# EAGLE board keyBoard_A (EAGLE 6.4)
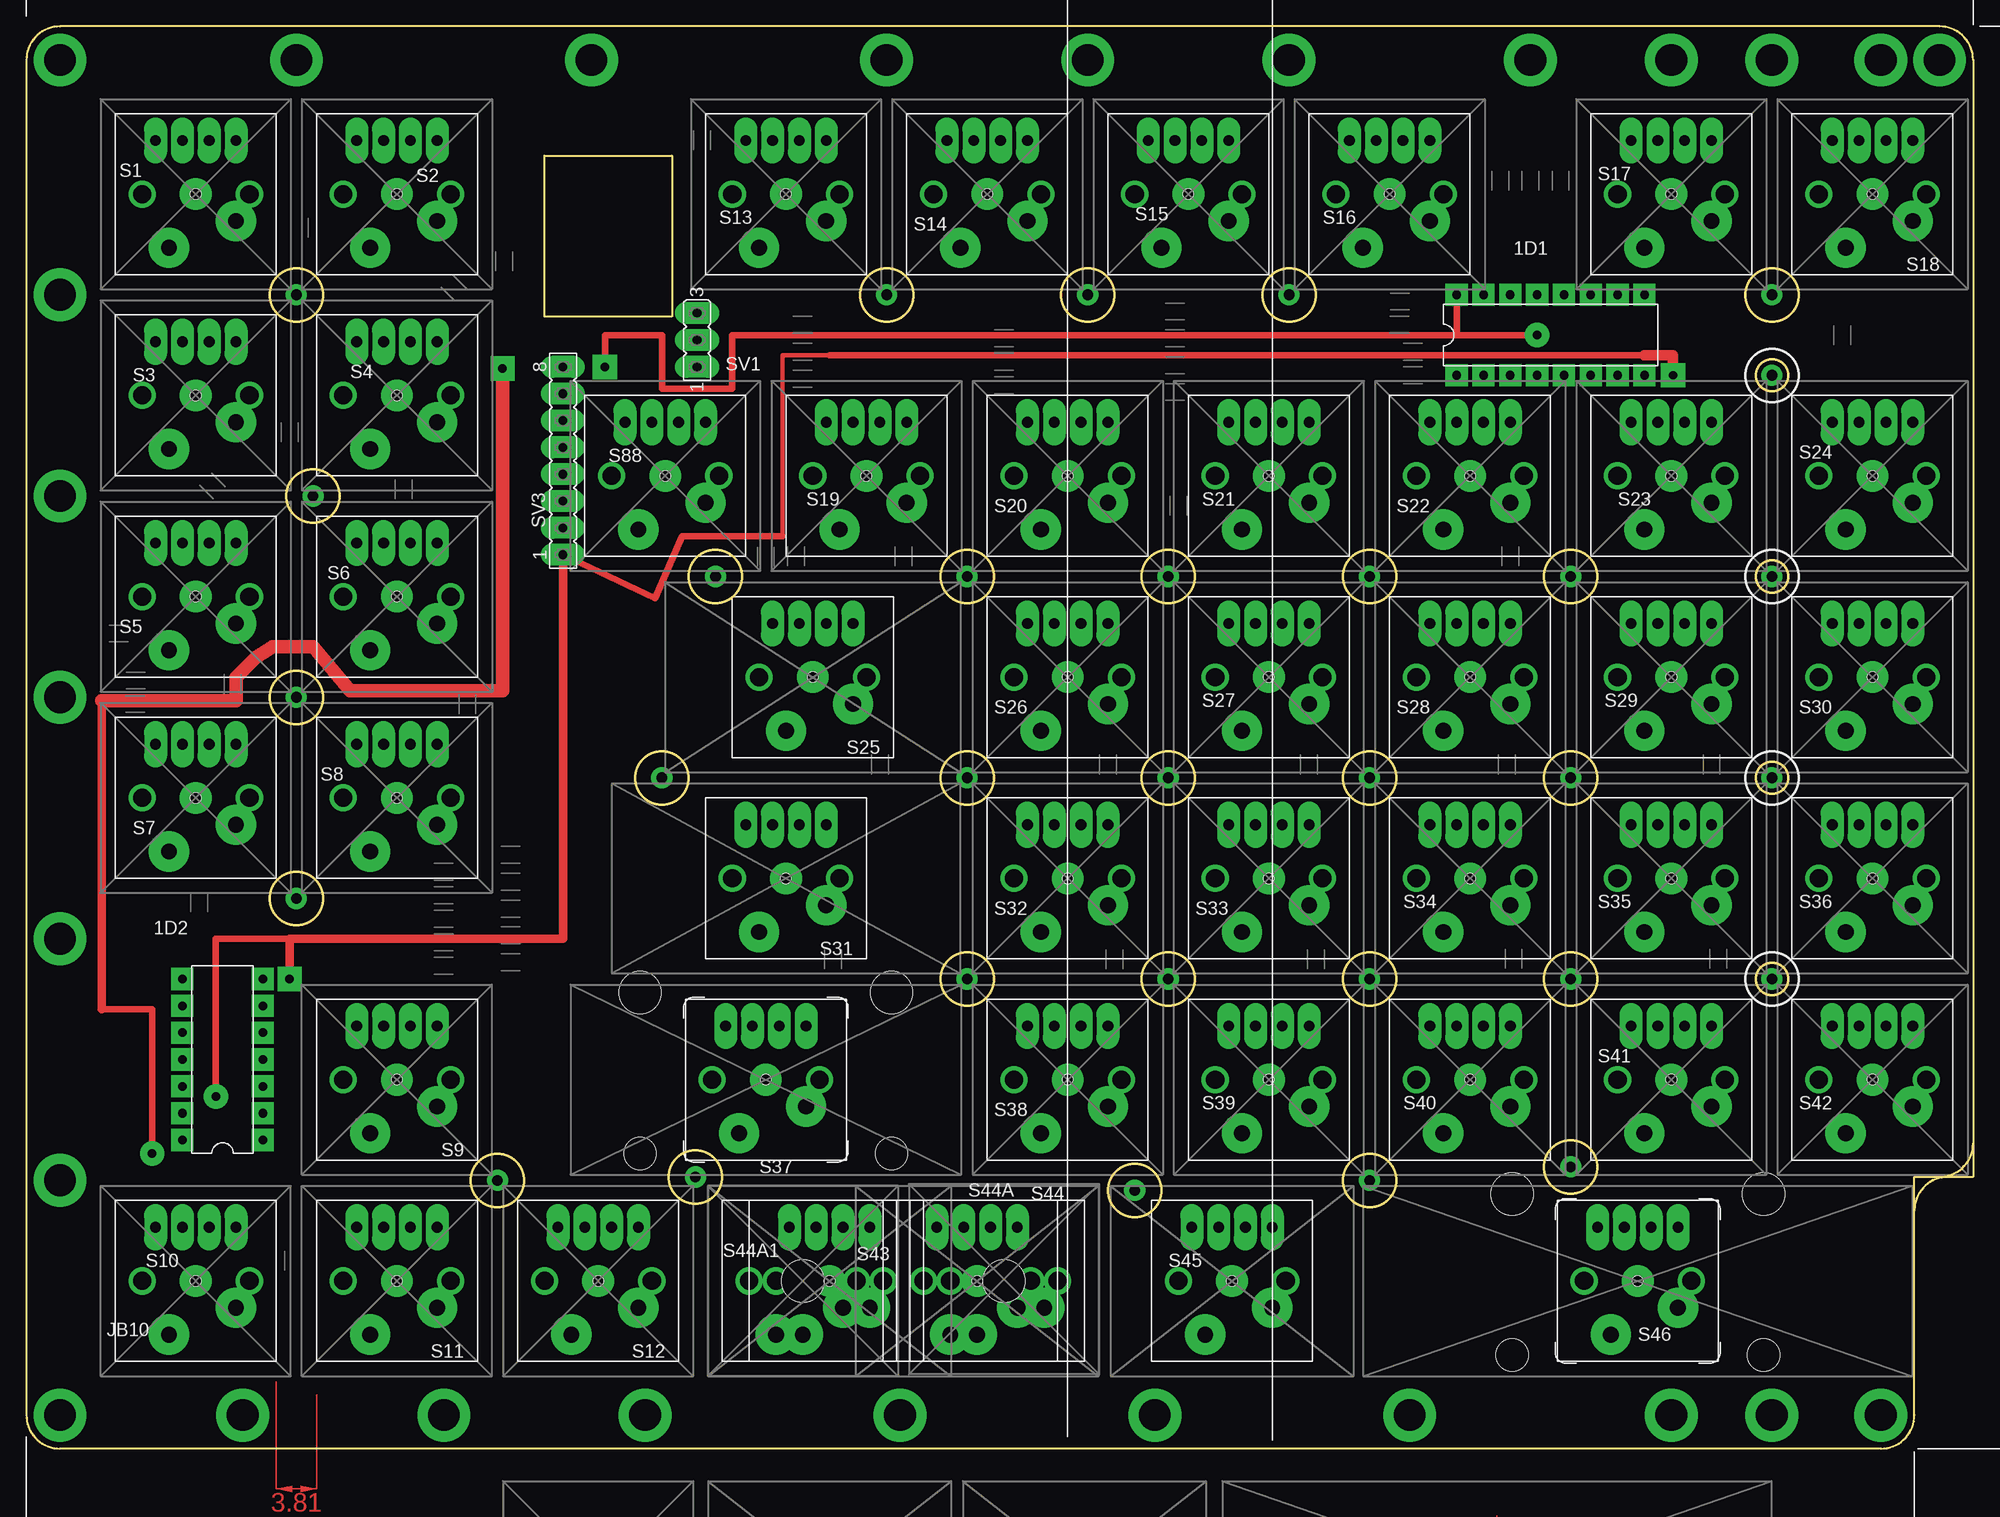
[diagram p1: board, top side]
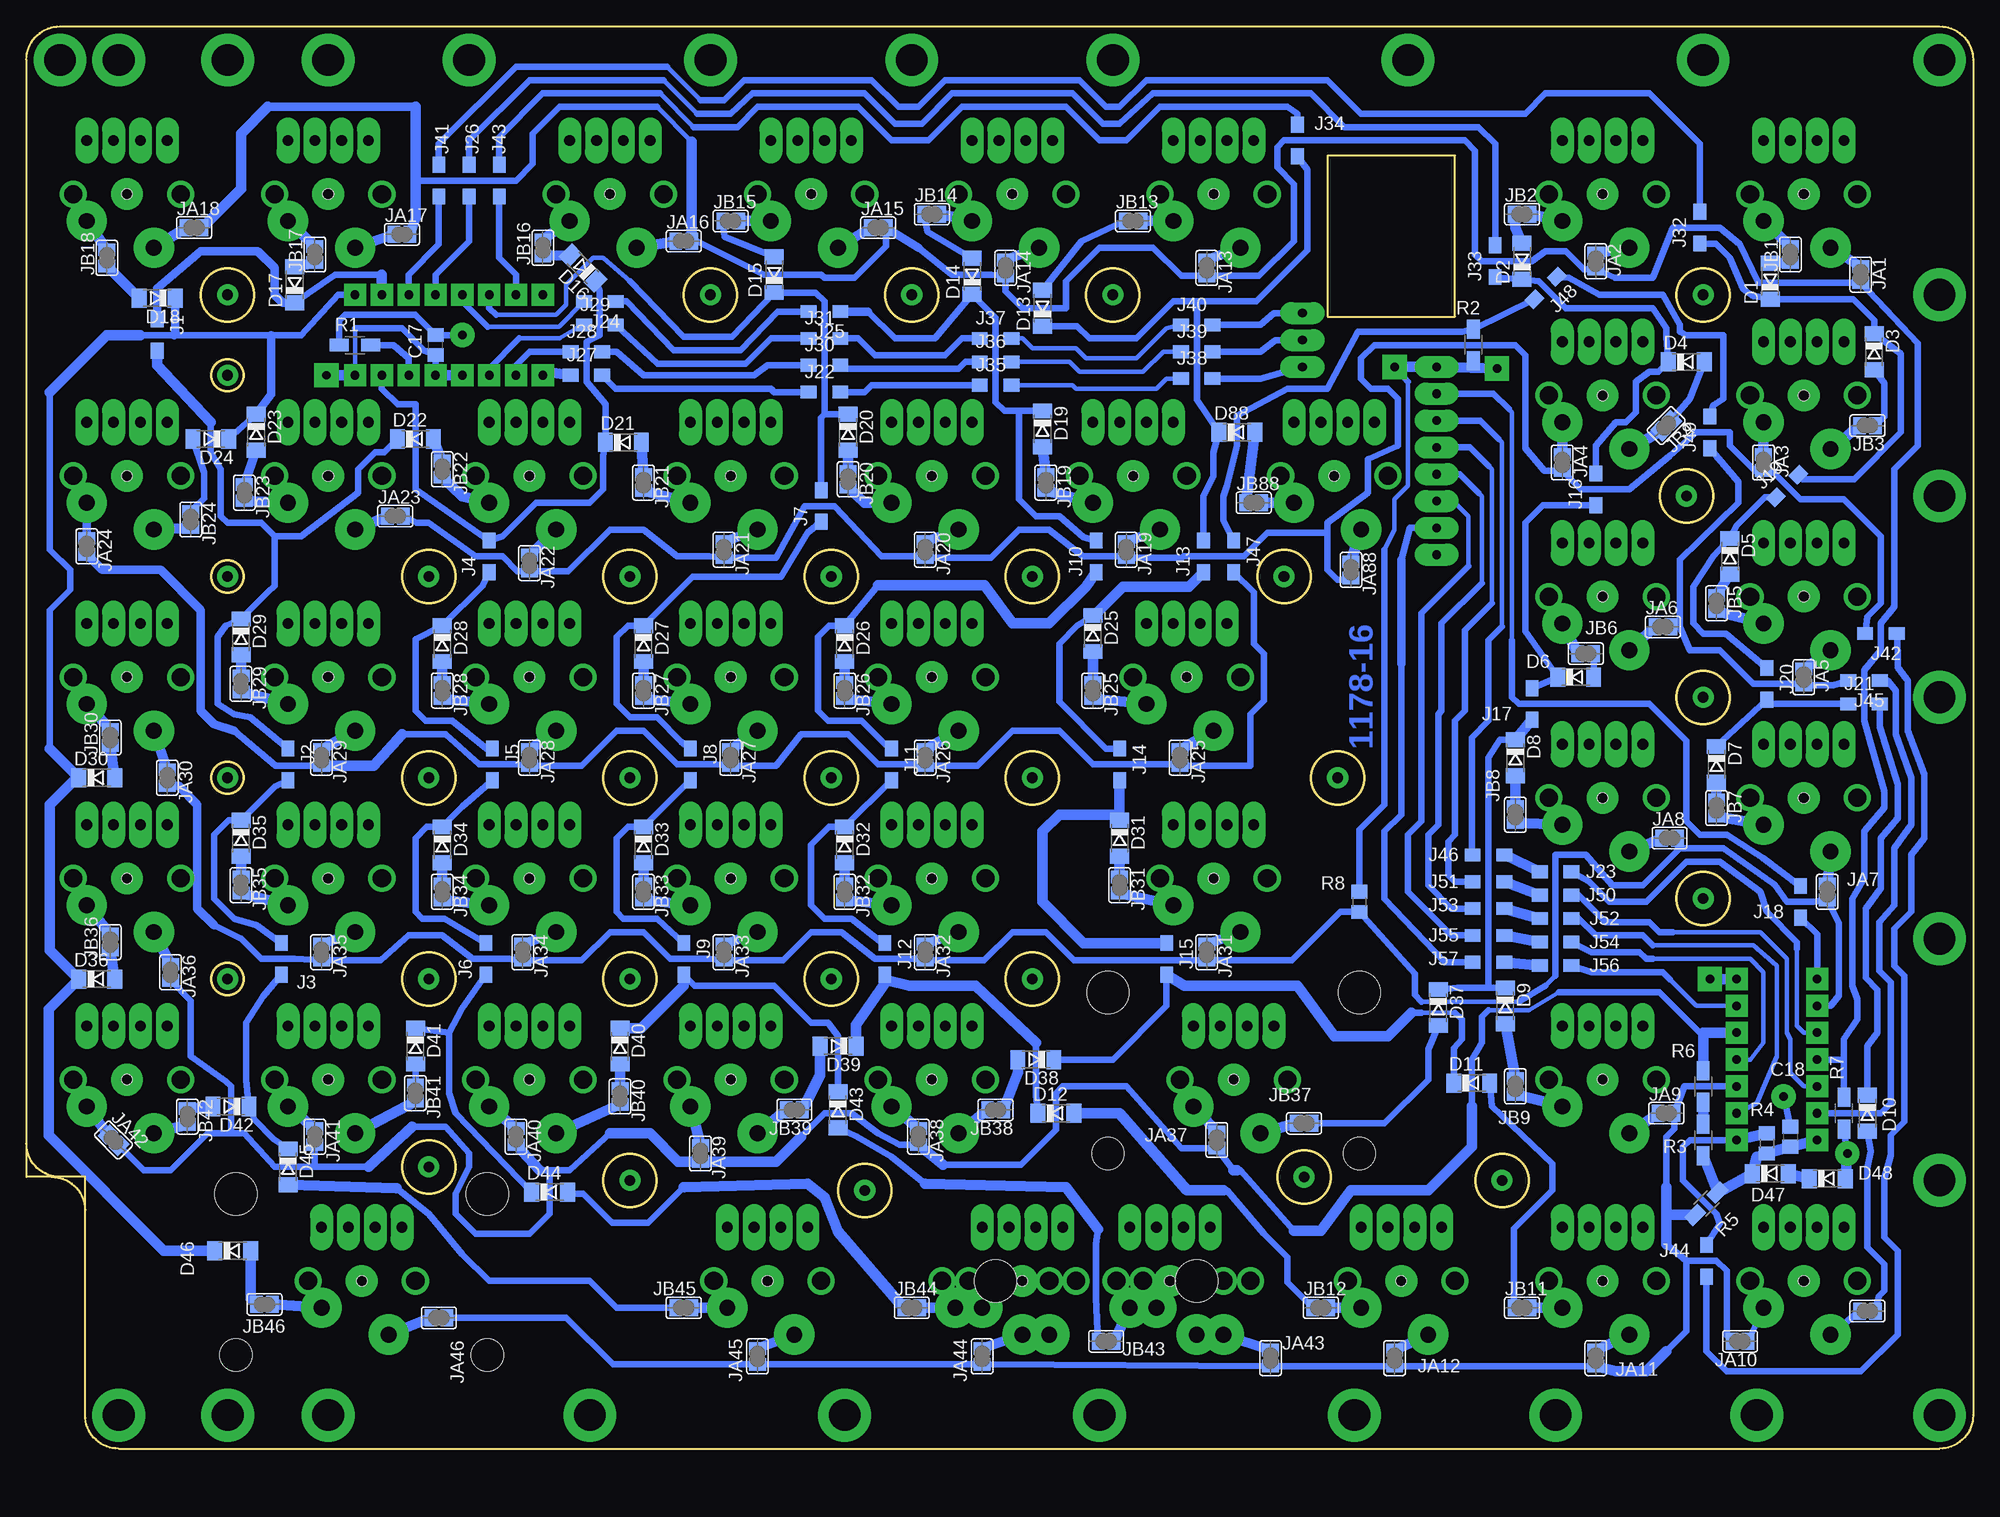
[diagram p2: board, bottom side, seen from below]

Size 184.31 x 134.62 mm. Coordinates in mm from the lower left corner, seen from the top.
Outline: 184.31,28.89 184.31,131.44 arc90 181.13,134.62 3.17,134.62 arc90 0,131.44 0,3.18 arc90 3.17,0 175.58,0 arc90 178.75,3.18 178.75,22.54
Outline: 184.31,28.89 184.31,25.72 181.93,25.72
Outline: 178.75,22.54 178.75,25.72 181.13,25.72
Outline: 181.13,25.72 181.93,25.72
Outline: 181.93,25.72 arc90 178.75,22.54
Outline: 181.13,25.72 arc90 184.31,28.89
Outline: 49.05,122.4 61.12,122.4 61.12,107.16 49.05,107.16 49.05,122.4
Outline: circle at 165.26,44.45 radius 1.5
Outline: circle at 146.21,26.67 radius 2.5
Outline: circle at 165.26,63.5 radius 1.5
Outline: circle at 165.26,82.55 radius 1.5
Outline: circle at 146.21,82.55 radius 2.5
Outline: circle at 146.21,63.5 radius 2.5
Outline: circle at 146.21,44.45 radius 2.5
Outline: circle at 127.16,25.4 radius 2.5
Outline: circle at 127.16,44.45 radius 2.5
Outline: circle at 127.16,63.5 radius 2.5
Outline: circle at 127.16,82.55 radius 2.5
Outline: circle at 108.11,82.55 radius 2.5
Outline: circle at 108.11,63.5 radius 2.5
Outline: circle at 108.11,44.45 radius 2.5
Outline: circle at 104.93,24.45 radius 2.5
Outline: circle at 89.06,44.45 radius 2.5
Outline: circle at 89.06,63.5 radius 2.5
Outline: circle at 89.06,82.55 radius 2.5
Outline: circle at 25.56,71.12 radius 2.5
Outline: circle at 27.15,90.17 radius 2.5
Copper layers (1*16): Top 0.035mm / dielectric 1.5mm / Bottom 0.035mm
Design rules "default": minimum track width 10mil, minimum drill 24mil, track to track 8mil, track to pad 8mil, pad to pad 8mil, via to via 8mil, smd to smd 8mil, copper to edge 40mil, drill to drill 8mil, minimum pad ring 10mil, minimum via ring 8mil, stop-mask expansion 4mil, vias tented up to drill 0mil, thermal gap 10mil
Net classes: 1 power: width 0.254 mm, drill 0.61 mm, clearance 0.254 mm; 2 gnd: width 0.305 mm, drill 0.559 mm, clearance 0.254 mm; 3 usbvcc: width 0.254 mm, drill 0.61 mm, clearance 0.254 mm; 4 aref: width 0.254 mm, drill 0.61 mm, clearance 0.254 mm

## Footprints (pad centres in the part's own frame; a part is rotated, then mirrored left to right if it is on the bottom)
DIL16 = drill 0.813 pad 2.1 square: 1 -8.89,-3.81; 2 -6.35,-3.81; 3 -3.81,-3.81; 4 -1.27,-3.81; 5 1.27,-3.81; 6 3.81,-3.81; 7 6.35,-3.81; 8 8.89,-3.81; 9 8.89,3.81; 10 6.35,3.81; 11 3.81,3.81; 12 1.27,3.81; 13 -1.27,3.81; 14 -3.81,3.81; 15 -6.35,3.81; 16 -8.89,3.81
DIL14 = drill 0.813 pad 2.1 square: 1 -7.62,-3.81; 2 -5.08,-3.81; 3 -2.54,-3.81; 4 0,-3.81; 5 2.54,-3.81; 6 5.08,-3.81; 7 7.62,-3.81; 8 7.62,3.81; 9 5.08,3.81; 10 2.54,3.81; 11 0,3.81; 12 -2.54,3.81; 13 -5.08,3.81; 14 -7.62,3.81
C0805 = smd 1.3 x 1.5: 1 -0.95,0; 2 0.95,0
SOD80C = smd 1.4 x 1.8 bottom: A -1.7,0; C 1.7,0
R1206W = smd 1.5 x 1.2 bottom: 1 1.499,0; 2 -1.499,0
SJ = smd 1.168 x 1.6 bottom: 1 0.762,0; 2 -0.762,0
SJ' = smd 1.168 x 1.6: 1 -0.762,0; 2 0.762,0
R1206W' = smd 1.8 x 1.2: 1 -1.499,0; 2 1.499,0
R0805 = smd 1.3 x 1.5: 1 -0.95,0; 2 0.95,0
CHERRY-MX-4P = drill 1.016 pad 2.184 long: D1 -3.81,-5.08; D2 3.81,-5.08; LED1 -1.27,-5.08; LED2 1.27,-5.08 | drill 1 pad 3: P$1 0,0 | drill 1.714 pad 1.93: P$3 -5.08,0; P$4 5.08,0 | drill 1.5 pad 3.81: SW1 -3.81,2.54; SW2 2.54,5.08 | hole 1: 0,0
CHERRY-MX = drill 0.8: P$1 0,0 | drill 1.714 pad 1.93: P$3 -5.08,0; P$4 5.08,0 | drill 1.5 pad 3.81: SW1 -3.81,2.54; SW2 2.54,5.08 | hole 4: 0,0
ZEALIOS-PCB_2U = drill 0.9 pad 3: P$1 -11.906,6.985; P$2 11.906,6.985 | drill 0.9 pad 4: P$3 11.906,-8.255; P$4 -11.906,-8.255 | hole 3.05: -11.9,7; 11.9,7 | hole 4: 11.9,-8.24; -11.9,-8.24
FE03-1 = drill 0.813 pad 2.1 long: 1 -2.54,0; 2 0,0; 3 2.54,0
FE08 = drill 0.813 pad 2.1 long: 1 -8.89,0; 2 -6.35,0; 3 -3.81,0; 4 -1.27,0; 5 1.27,0; 6 3.81,0; 7 6.35,0; 8 8.89,0

## Placement (x,y rotation side)
1D1  74HC138N  [DIL16]  144.3,105.41 0 top
1D2  74HC04N  [DIL14]  18.57,36.83 90 top
C17  100n  [C0805]  145.57,104.46 90 bottom
C18  100n  [C0805]  17.3,29.53 270 bottom
D1  LL4148  [SOD80C]  19.21,110.49 270 top
D2  LL4148  [SOD80C]  42.7,112.4 270 top
D3  LL4148  [SOD80C]  9.37,103.82 90 top
D4  LL4148  [SOD80C]  27.15,102.87 0 top
D5  LL4148  [SOD80C]  23.02,84.46 90 top
D6  LL4148  [SOD80C]  37.62,73.03 0 top
D7  LL4148  [SOD80C]  24.29,64.77 90 top
D8  LL4148  [SOD80C]  43.34,65.41 90 top
D9  LL4148  [SOD80C]  44.29,41.91 90 top
D10  LL4148  [SOD80C]  10,31.75 90 top
D11  LL4148  [SOD80C]  47.47,34.61 0 top
D12  LL4148  [SOD80C]  86.84,31.75 0 top
D13  LL4148  [SOD80C]  88.11,107.95 270 top
D14  LL4148  [SOD80C]  94.77,110.96 270 top
D15  LL4148  [SOD80C]  113.51,111.12 270 top
D16  LL4148  [SOD80C]  131.6,111.76 225 top
D17  LL4148  [SOD80C]  158.91,110.17 270 top
D18  LL4148  [SOD80C]  171.93,108.9 180 top
D19  LL4148  [SOD80C]  88.11,96.52 90 top
D20  LL4148  [SOD80C]  106.52,96.2 90 top
D21  LL4148  [SOD80C]  127.79,95.25 0 top
D22  LL4148  [SOD80C]  147.48,95.57 0 top
D23  LL4148  [SOD80C]  162.56,96.2 90 top
D24  LL4148  [SOD80C]  166.85,95.57 180 top
D25  LL4148  [SOD80C]  83.34,77.15 90 top
D26  LL4148  [SOD80C]  106.84,76.2 90 top
D27  LL4148  [SOD80C]  125.89,76.2 90 top
D28  LL4148  [SOD80C]  144.94,76.2 90 top
D29  LL4148  [SOD80C]  163.99,76.84 90 top
D30  LL4148  [SOD80C]  177.64,63.5 0 top
D31  LL4148  [SOD80C]  80.8,57.79 90 top
D32  LL4148  [SOD80C]  106.84,57.15 90 top
D33  LL4148  [SOD80C]  125.89,57.15 90 top
D34  LL4148  [SOD80C]  144.94,57.15 90 top
D35  LL4148  [SOD80C]  163.99,57.79 90 top
D36  LL4148  [SOD80C]  177.64,44.45 0 top
D37  LL4148  [SOD80C]  50.64,41.75 90 top
D38  LL4148  [SOD80C]  88.74,36.83 180 top
D39  LL4148  [SOD80C]  107.47,38.1 180 top
D40  LL4148  [SOD80C]  128.11,38.1 90 top
D41  LL4148  [SOD80C]  147.48,38.1 90 top
D42  LL4148  [SOD80C]  164.94,32.38 180 top
D43  LL4148  [SOD80C]  107.47,32.07 90 top
D44  LL4148  [SOD80C]  134.78,24.29 0 top
D45  LL4148  [SOD80C]  159.54,26.67 90 top
D46  LL4148  [SOD80C]  164.78,18.73 0 top
D47  LL4148  [SOD80C]  19.21,26.04 0 top
D48  LL4148  [SOD80C]  13.81,25.56 0 top
D88  LL4148  [SOD80C]  69.69,96.2 0 top
J1  J  [R1206W]  171.93,105.41 90 top
J2  J  [R1206W]  159.54,64.77 90 top
J3  J  [R1206W]  160.18,46.35 270 top
J4  J  [R1206W]  140.49,84.46 270 top
J5  J  [R1206W]  140.18,64.77 90 top
J6  J  [R1206W]  140.81,46.35 270 top
J7  J  [R1206W]  109.06,89.22 270 top
J8  J  [R1206W]  121.44,64.77 90 top
J9  J  [R1206W]  122.08,46.35 90 top
J10  J  [R1206W]  83.03,84.46 270 top
J11  J  [R1206W]  102.39,64.77 90 top
J12  J  [R1206W]  103.03,46.35 90 top
J13  J  [R1206W]  72.87,84.46 270 top
J14  J  [R1206W]  80.8,64.77 90 top
J15  J  [R1206W]  76.36,46.35 90 top
J16  J  [R1206W]  35.72,90.81 270 top
J17  J  [R1206W]  41.75,70.49 90 top
J18  J  [R1206W]  16.35,51.75 90 top
J19  J  [R1206W]  17.62,91.12 315 top
J20  J  [R1206W]  19.53,72.39 90 top
J21  J  [R1206W]  10.32,70.49 0 top
J22  J  [R1206W]  108.74,100.01 0 top
J23  J  [R1206W]  39.53,54.61 0 top
J24  J  [R1206W]  130.02,108.59 180 top
J25  J  [R1206W]  108.74,107.63 180 top
J26  J  [R1206W]  142.4,120.01 90 top
J27  J  [R1206W]  131.29,101.6 0 top
J28  J  [R1206W]  131.29,103.82 0 top
J29  J  [R1206W]  130.02,106.36 0 top
J30  J  [R1206W]  108.74,102.55 0 top
J31  J  [R1206W]  108.74,105.09 0 top
J32  J  [R1206W]  25.88,115.57 270 top
J33  J  [R1206W]  45.24,112.4 270 top
J34  J  [R1206W]  63.98,123.82 270 top
J35  J  [R1206W]  92.55,100.65 0 top
J36  J  [R1206W]  92.55,102.87 0 top
J37  J  [R1206W]  92.55,105.09 0 top
J38  J  [R1206W]  73.5,101.28 0 top
J39  J  [R1206W]  73.5,103.82 0 top
J40  J  [R1206W]  73.5,106.36 0 top
J41  J  [R1206W]  145.26,120.01 90 top
J42  J  [R1206W]  8.73,77.15 180 top
J43  J  [R1206W]  139.54,120.01 90 top
J44  J  [R1206W]  25.24,17.78 90 top
J45  J  [R1206W]  10.32,72.71 180 top
J46  J  [R1206W]  45.88,56.2 0 top
J47  J  [R1206W]  70.01,84.46 90 top
J48  J  [R1206W]  40.48,109.85 135 top
J49  J  [R1206W]  24.92,96.2 270 top
J50  J  [R1206W]  39.53,52.39 0 top
J51  J  [R1206W]  45.88,53.66 0 top
J52  J  [R1206W]  39.53,50.16 0 top
J53  J  [R1206W]  45.88,51.12 0 top
J54  J  [R1206W]  39.53,47.94 0 top
J55  J  [R1206W]  45.88,48.58 0 top
J56  J  [R1206W]  39.53,45.72 0 top
J57  J  [R1206W]  45.88,46.04 0 top
JA1  [SJ]  10.64,111.12 90 top
JA2  [SJ]  35.72,112.4 90 top
JA3  [SJ]  19.84,93.34 90 top
JA4  [SJ]  38.89,93.34 90 top
JA5  [SJ]  16.03,73.03 90 top
JA6  [SJ]  29.37,77.79 0 top
JA7  [SJ]  13.81,52.71 90 top
JA8  [SJ]  28.73,57.79 0 top
JA9  [SJ]  29.05,31.75 0 top
JA10  [SJ]  22.07,10.16 180 top
JA11  [SJ]  35.72,8.57 90 top
JA12  [SJ]  54.77,8.57 90 top
JA13  [SJ]  72.55,111.76 90 top
JA14  [SJ]  91.6,111.76 90 top
JA15  [SJ]  103.66,115.57 0 top
JA16  [SJ]  122.08,114.3 0 top
JA17  [SJ]  148.75,114.94 0 top
JA18  [SJ]  168.43,115.57 0 top
JA19  [SJ]  80.17,85.09 90 top
JA20  [SJ]  99.22,85.09 90 top
JA21  [SJ]  118.27,85.09 90 top
JA22  [SJ]  136.68,83.82 90 top
JA23  [SJ]  149.38,88.26 0 top
JA24  [SJ]  178.59,85.41 90 top
JA25  [SJ]  75.09,65.41 90 top
JA26  [SJ]  99.22,65.41 90 top
JA27  [SJ]  117.63,65.41 90 top
JA28  [SJ]  136.68,65.41 90 top
JA29  [SJ]  156.37,65.41 90 top
JA30  [SJ]  170.97,63.5 90 top
JA31  [SJ]  72.55,46.99 90 top
JA32  [SJ]  99.22,46.99 90 top
JA33  [SJ]  118.27,46.99 90 top
JA34  [SJ]  137.32,46.99 90 top
JA35  [SJ]  156.37,46.99 90 top
JA36  [SJ]  170.66,45.09 90 top
JA37  [SJ]  71.6,29.21 90 top
JA38  [SJ]  99.85,29.53 90 top
JA39  [SJ]  120.49,27.94 90 top
JA40  [SJ]  137.95,29.53 90 top
JA41  [SJ]  157,29.53 90 top
JA42  [SJ]  176.05,29.21 45 top
JA43  [SJ]  66.52,8.57 90 top
JA44  [SJ]  93.82,8.73 90 top
JA45  [SJ]  115.09,8.73 90 top
JA46  [SJ]  145.26,12.38 0 top
JA88  [SJ]  58.9,83.19 90 top
JB1  [SJ]  17.3,113.03 270 top
JB2  [SJ']  42.7,116.84 0 bottom
JB3  [SJ]  10,96.84 180 top
JB4  [SJ]  29.05,96.84 135 top
JB5  [SJ']  24.29,80.01 270 bottom
JB6  [SJ]  36.67,75.25 180 top
JB7  [SJ]  24.29,60.64 90 top
JB8  [SJ]  43.34,60.01 90 top
JB9  [SJ]  43.34,34.29 90 top
JB10  [SJ]  10,13.02 180 top
JB11  [SJ]  42.7,13.34 0 top
JB12  [SJ]  61.75,13.34 0 top
JB13  [SJ]  79.53,116.21 0 top
JB14  [SJ']  98.58,116.84 0 bottom
JB15  [SJ']  117.63,116.21 0 bottom
JB16  [SJ]  135.41,113.66 270 top
JB17  [SJ]  157,113.03 270 top
JB18  [SJ]  176.69,112.71 270 top
JB19  [SJ]  87.79,91.44 90 top
JB20  [SJ]  106.52,91.76 90 top
JB21  [SJ]  125.89,91.44 90 top
JB22  [SJ]  144.94,92.71 90 top
JB23  [SJ]  163.67,90.49 90 top
JB24  [SJ]  168.75,87.95 90 top
JB25  [SJ]  83.34,71.75 90 top
JB26  [SJ]  106.84,71.75 90 top
JB27  [SJ]  125.89,71.75 90 top
JB28  [SJ]  144.94,71.75 90 top
JB29  [SJ]  163.99,72.39 90 top
JB30  [SJ]  176.37,67.31 270 top
JB31  [SJ]  80.8,53.34 90 top
JB32  [SJ]  106.84,52.71 90 top
JB33  [SJ]  125.89,52.71 90 top
JB34  [SJ]  144.94,52.71 90 top
JB35  [SJ]  163.99,53.34 90 top
JB36  [SJ]  176.37,47.94 270 top
JB37  [SJ]  63.34,30.8 180 top
JB38  [SJ]  92.55,32.07 180 top
JB39  [SJ]  111.6,32.07 180 top
JB40  [SJ]  128.11,33.34 90 top
JB41  [SJ]  147.48,33.66 90 top
JB42  [SJ]  169.07,31.43 90 top
JB43  [SJ]  82.07,10.16 0 top
JB44  [SJ]  100.49,13.34 0 top
JB45  [SJ]  122.08,13.34 0 top
JB46  [SJ]  161.77,13.65 0 top
JB88  [SJ]  68.1,89.53 0 top
R1  [R1206W']  153.19,104.46 0 bottom
R2  10k  [R1206W']  47.31,104.46 270 bottom
R3  0  [R1206W']  25.56,29.21 90 bottom
R4  10k  [R0805]  19.53,28.89 90 bottom
R5  10k  [R1206W']  25.24,23.18 225 bottom
R6  10k  [R1206W']  25.56,34.29 90 bottom
R7  10k  [R1206W']  12.22,31.75 90 bottom
R8  10k  [R0805]  58.1,51.75 90 bottom
S1  ESC  [CHERRY-MX-4P]  16.03,118.75 180 top
S2  Scroll Lock  [CHERRY-MX-4P]  35.08,118.75 180 top
S3  Ins  [CHERRY-MX-4P]  16.03,99.69 180 top
S4  Pause  [CHERRY-MX-4P]  35.08,99.69 180 top
S5  Home  [CHERRY-MX-4P]  16.03,80.65 180 top
S6  PageUp  [CHERRY-MX-4P]  35.08,80.65 180 top
S7  End  [CHERRY-MX-4P]  16.03,61.6 180 top
S8  PageDown  [CHERRY-MX-4P]  35.08,61.6 180 top
S9  Up  [CHERRY-MX-4P]  35.08,34.92 180 top
S10  Left  [CHERRY-MX-4P]  16.03,15.88 180 top
S11  Down  [CHERRY-MX-4P]  35.08,15.88 180 top
S12  Right  [CHERRY-MX-4P]  54.13,15.88 180 top
S13  F1  [CHERRY-MX-4P]  71.91,118.75 180 top
S14  F2  [CHERRY-MX-4P]  90.96,118.75 180 top
S15  F3  [CHERRY-MX-4P]  110.01,118.75 180 top
S16  F4  [CHERRY-MX-4P]  129.06,118.75 180 top
S17  F5  [CHERRY-MX-4P]  155.73,118.75 180 top
S18  F6  [CHERRY-MX-4P]  174.78,118.75 180 top
S19  1  [CHERRY-MX-4P]  79.53,92.07 180 top
S20  2  [CHERRY-MX-4P]  98.58,92.07 180 top
S21  3  [CHERRY-MX-4P]  117.63,92.07 180 top
S22  4  [CHERRY-MX-4P]  136.68,92.07 180 top
S23  5  [CHERRY-MX-4P]  155.73,92.07 180 top
S24  6  [CHERRY-MX-4P]  174.78,92.07 180 top
S25  TAB  [CHERRY-MX-4P]  74.45,73.03 180 top
S26  Q  [CHERRY-MX-4P]  98.58,73.03 180 top
S27  W  [CHERRY-MX-4P]  117.63,73.03 180 top
S28  E  [CHERRY-MX-4P]  136.68,73.03 180 top
S29  R  [CHERRY-MX-4P]  155.73,73.03 180 top
S30  T  [CHERRY-MX-4P]  174.78,73.03 180 top
S31  LCtrl  [CHERRY-MX-4P]  71.91,53.98 180 top
S32  A  [CHERRY-MX-4P]  98.58,53.98 180 top
S33  S  [CHERRY-MX-4P]  117.63,53.98 180 top
S34  D  [CHERRY-MX-4P]  136.68,53.98 180 top
S35  F  [CHERRY-MX-4P]  155.73,53.98 180 top
S36  G  [CHERRY-MX-4P]  174.78,53.98 180 top
S37  L Shift  [CHERRY-MX-4P]  70.01,34.92 180 top
S38  Z  [CHERRY-MX-4P]  98.58,34.92 180 top
S39  X  [CHERRY-MX-4P]  117.63,34.92 180 top
S40  C  [CHERRY-MX-4P]  136.68,34.92 180 top
S41  V  [CHERRY-MX-4P]  155.73,34.92 180 top
S42  B  [CHERRY-MX-4P]  174.78,34.92 180 top
S43  Caps Lock  [CHERRY-MX-4P]  76.04,15.88 180 top
S44  FN1  [CHERRY-MX-4P]  90.01,15.88 180 top
S44A  Fn1  [CHERRY-MX]  92.55,15.88 180 top
S44A1  Caps Lock  [CHERRY-MX]  73.5,15.88 180 top
S45  L_Alt  [CHERRY-MX-4P]  114.14,15.88 180 top
S46  Space  [CHERRY-MX-4P]  152.56,15.88 180 top
S88  ~Ё  [CHERRY-MX-4P]  60.48,92.07 180 top
STAB_LSH  STAB  [ZEALIOS-PCB_2U]  70.01,34.92 180 top
STAB_LSP  STAB  [ZEALIOS-PCB_2U]  152.56,15.88 180 top
SV1  [FE03-1]  63.5,104.93 90 top
SV3  [FE08]  50.8,93.5 90 top
U$1  [18X18]  14.76,120.01 0 top
U$2  [18X18]  33.81,120.01 0 top
U$3  [18X18]  14.76,100.97 0 top
U$4  [18X18]  14.76,81.91 0 top
U$5  [18X18]  33.81,100.97 0 top
U$6  [18X18]  14.76,62.87 0 top
U$7  [18X18]  33.81,81.91 0 top
U$8  [18X18]  33.81,62.87 0 top
U$9  [18X18]  93.82,17.3 270 top
U$10  [18X18]  33.81,14.61 90 top
U$11  [18X18]  33.81,33.66 90 top
U$12  [18X18]  116.36,33.66 90 top
U$13  [18X18]  14.76,14.61 90 top
U$14  [18X18]  74.77,17.14 270 top
U$15  [18X23]  76.04,15.88 0 top
U$16  [18X23]  114.14,15.88 0 top
U$17  [18X52]  152.56,15.88 0 top
U$18  [18X18]  97.31,36.2 0 top
U$19  [18X18]  173.51,36.2 0 top
U$20  [18X18]  154.46,36.2 0 top
U$21  [18X18]  135.41,36.2 0 top
U$22  [18X37]  70.01,34.92 0 top
U$23  [18X18]  116.36,52.71 90 top
U$24  [18X18]  97.31,55.24 0 top
U$25  [18X18]  173.51,55.24 0 top
U$26  [18X18]  154.46,55.24 0 top
U$27  [18X18]  135.41,55.24 0 top
U$28  [18X33]  71.91,53.98 0 top
U$29  [18X18]  116.36,71.75 90 top
U$30  [18X18]  97.31,74.29 0 top
U$31  [18X18]  173.51,74.29 0 top
U$32  [18X18]  154.46,74.29 0 top
U$33  [18X18]  135.41,74.29 0 top
U$34  [18X28]  74.45,73.03 0 top
U$35  [18X18]  116.36,90.81 90 top
U$36  [18X18]  97.31,93.34 0 top
U$37  [18X18]  173.51,93.34 0 top
U$38  [18X18]  154.46,93.34 0 top
U$39  [18X18]  135.41,93.34 0 top
U$40  [18X18]  78.26,93.34 0 top
U$41  [18X18]  173.51,120.01 0 top
U$42  [18X18]  154.46,120.01 0 top
U$43  [18X18]  108.74,120.01 0 top
U$44  [18X18]  127.79,120.01 0 top
U$45  [18X18]  89.69,120.01 0 top
U$46  [18X18]  70.64,120.01 0 top
U$47  [18X52]  139.22,-12.06 0 top  (outside the outline)
U$48  [18X23]  100.17,-12.06 0 top  (outside the outline)
U$49  [18X18]  52.86,-10.79 0 top  (outside the outline)
U$50  [18X23]  76.04,-12.06 0 top  (outside the outline)
U$51  [18X23]  77.31,-31.11 0 top  (outside the outline)
U$52  [18X18]  98.58,-29.84 0 top  (outside the outline)
U$53  [18X52]  136.68,-31.11 0 top  (outside the outline)
U$82  [18X18]  52.86,17.14 0 top
U$88  [18X18]  59.21,93.34 0 top
U$91  [18X23]  90.01,15.88 0 top

## Tracks (layer width: path | path; a pad name or v marks a point on that pad's centre or on a via)
1
  Bottom 0.61: J32.1 24.38,114.07 23.02,112.71 21.75,109.72 20.93,109.17 | 20.93,109.17 20.78,109.07 | 20.93,109.17 D1.C 11.36,108.79 9.37,106.79 D3.C 6.83,103.62 6.83,96.2 11.27,91.76 16.14,91.76 J19.2
1J
  Bottom 0.61: J20.1 23.42,77.15 25.56,77.15 26.51,78.1 26.51,81.6 24.61,84.46 D5.C 22.36,87.43 19.72,90.06 J19.1
1J2
  Bottom 0.61: D7.C J20.2 19.44,70.49 J21.1
1J3
  Bottom 0.61: J21.2 8.82,68.35 7.14,62.87 7.14,59.69 8.73,57.79 8.73,53.02 10.16,51.12 10.16,44.56 9.05,43.45 9.05,39.37 10,38.1 D10.C
2
  Bottom 0.61: J33.1 D2.C 41.12,110.49 38.58,107.95 30.32,107.95 29.05,106.04 29.05,105.21 D4.C 29.8,101.92 30.64,101.92 31.91,100.97 31.91,98.11 32.86,97.16 33.81,97.16 35.72,94.93 J16.2
2J
  Bottom 0.61: J16.1 40.71,89.31 42.39,87.63 42.39,77.36 D6.C J17.1
2J2
  Bottom 0.61: D8.C 44.81,67.1 45.88,65.41 45.88,43.61 | D9.C 45.88,43.61 | 45.88,43.61 48.85,43.61 D37.C
  Bottom 1.016: D8.C J17.2
3
  Bottom 0.61: D13.C 84.82,106.25 83.66,105.09 79.22,105.09 75.72,108.59 73.5,108.59 | 73.5,108.59 67.87,108.59 63.02,113.44 63.02,121.06 J34.1 | J13.2 72.87,90.17 71.91,92.07 71.91,94.3 D88.C 73.5,99.26 73.5,108.59
3J
  Bottom 0.61: D25.C 84.82,77.9 86.52,76.2 86.52,70.71 82.07,66.27 J14.1
  Bottom 1.016: D25.C 83.23,78.85 80.49,81.6 74.22,81.6 J13.1
3J2
  Bottom 1.016: J14.2 D31.C 81.33,60.01 86.52,60.01 88.11,58.42 88.11,51.75 84.21,47.85 J15.1
3J3
  Bottom 0.406: 49.05,41.27 52.23,41.27
  Bottom 0.61: D11.C 49.17,37.9 48.42,38.73 48.42,40.64 49.05,41.27 | 53.18,41.27 52.23,41.27 | J15.2 76.36,41.91 81.44,36.83 D38.C
  Bottom 1.016: J15.2 74.68,43.81 63.98,43.81 60.48,39.05 55.4,39.05 53.18,41.27
4
  Bottom 0.61: 104.62,107.63 102.08,105.09 98.27,105.09 D14.C 92.55,107.04 92.55,99.06 91.71,98.22 90.33,98.22 | D19.C 90.33,98.22 | J10.2 84.21,86.27 86.52,88.26 88.74,88.26 90.33,89.85 90.33,98.22
  Bottom 0.813: 104.62,107.63 J25.1
4J
  Bottom 0.61: 103.66,81.71 D26.C 108.31,77.9 109.38,76.84 109.38,69.85 108.43,68.9 105.25,68.9 103.03,66.68 J11.1
  Bottom 1.016: 103.66,81.71 93.62,81.71 90.96,78.1 87.47,78.1 83.98,81.6 J10.1
4J2
  Bottom 0.61: J11.2 D32.C 108.31,58.85 110.01,57.15 110.01,51.44 108.74,50.16 106.2,50.16 103.26,47.85 J12.1
4J3
  Bottom 0.61: 88.74,38.42 88.74,33.45 D12.C
  Bottom 1.016: J12.2 102.83,44.34 | 102.83,44.34 100.72,43.81 94.46,43.81 88.74,38.42 | D39.C 105.77,40.12 102.83,44.34
5
  Bottom 0.406: 139.86,107.31 134.14,107.31 133.19,108.27 133.19,110.17 130.65,112.71 129.7,112.71 127.16,110.49
  Bottom 0.61: 139.86,107.31 140.49,107.95 1D1.14 | D20.C 108.74,97.9 | 108.74,97.9 108.74,108.59 109.58,109.43 D15.C 117.52,105.25 122.08,105.25 127.16,110.49 | J7.2 109.06,97.59 108.74,97.9
5J
  Bottom 0.61: J8.1 122.31,66.9 124.62,69.22 127.16,69.22 128.43,70.49 128.43,76.84 127.36,77.9 D27.C 121.24,82.55 112.87,82.55 110.33,86.68 J7.1
5J2
  Bottom 0.61: J8.2 121.47,63.27 D33.C 127.36,58.85 128.43,57.79 128.43,50.8 127.79,50.16 124.62,50.16 J9.1
5J3
  Bottom 0.61: J9.2 121.04,43.81 113.51,43.81 110.01,40.32 108.43,40.32 107.47,39.05 D43.C
  Bottom 1.016: D40.C 126.09,39.8 122.08,43.81 J9.2
6
  Bottom 0.61: D16.C 130.22,110.06 130.02,109.54 130.02,105.41 131.29,104.78 131.29,100.97 129.49,98.85 D21.C 129.7,93.98 129.7,90.81 130.97,89.53 136.05,89.53 139.22,86.36 J4.2 147.48,90.81 147.48,98.85 149.18,98.85 150.65,100.33 1D1.7
6J
  Bottom 0.61: J4.1 141.13,81.69 D28.C 147.48,76.63 147.48,69.85 146.53,68.9 143.99,68.9 140.72,66.27 J5.1
6J2
  Bottom 0.61: J5.2 143.03,60.76 D34.C 146.41,58.85 147.48,57.79 147.48,50.8 146.84,50.16 144.71,50.16 J6.2
6J3
  Bottom 0.61: J6.1 143.03,41.7 144.3,39.37 | D44.C 143.67,31.75 144.3,33.66 144.3,39.37 | D41.C 144.3,39.37
7
  Bottom 0.61: J2.1 163.12,69.22 164.62,69.53 166.21,70.49 166.21,76.84 165.46,77.9 D29.C 161.45,81.05 160.81,81.69 160.81,86.36 | 160.81,86.36 162.08,87.63 165.26,87.63 165.89,88.26 165.89,92.71 166.85,94.3 166.85,97.16 | D22.C 150.45,94.3 151.29,94.3 152.88,92.71 152.88,90.49 158.27,86.36 160.81,86.36
  Bottom 1.016: 166.85,97.16 171.93,102.55 J1.2
7J
  Bottom 0.61: 150.65,111.12 155.1,111.12 D17.C
  Bottom 0.813: J1.1 171.93,109.85 167.8,113.35 162.4,113.35 160.81,111.76 160.81,109.22 160.07,108.47 D17.C
  Bottom 1.016: 1D1.10 150.65,111.12
7J2
  Bottom 0.61: J2.2 160.81,62.66 D35.C 165.15,59.49 166.53,58.1 166.53,52.07 164.62,50.16 162.49,49.53 J3.2
7J3
  Bottom 0.61: J3.1 161.88,42.84 163.49,40.3 163.49,34.9 D42.C 162.72,31.12 160.93,29.32 D45.C
8
  Bottom 0.61: 173.51,105.41 170.34,105.41 161.13,105.41 158.27,105.41 154.78,109.22 1D1.9 | D24.C D23.C | 182.09,66.25 182.09,79.38 180.18,81.28 180.18,83.19 182.09,85.09 182.09,100.01
  Bottom 0.813: D23.C 161.13,99.81 161.13,105.41 | D18.C 170.23,105.52 170.34,105.41
  Bottom 1.016: 182.09,66.25 D30.C 179.55,63.5 182.09,60.96 182.09,47.2 D36.C 182.2,41.59 182.2,29.64 171.29,18.73 D46.C | 173.51,105.41 176.69,105.41 182.09,100.01
+5V  (via drill 0.8 pad 2.3)
  Top 0.61: v143.03,105.41 135.41,105.41 | 135.41,105.41 66.83,105.41 66.83,100.33 60.17,100.33 60.17,105.41 54.77,105.41 v54.77,102.39 | 1D1.16 135.41,105.41 | 7.14,41.59 11.91,41.59 v11.91,27.94
  Top 0.813: 7.14,70.8 7.14,41.59
  Top 1.27: v45.08,102.24 45.08,71.75 30.64,71.75 27.15,75.88 23.34,75.88 21.75,74.93 19.84,73.03 19.84,70.8 7.14,70.8
  Bottom 0.406: 53.5,100.97 53.5,91.12 54.77,89.85 54.77,87 55.72,85.09
  Bottom 0.61: v143.03,105.41 C17.2 147.48,107.31 154.15,107.31 154.69,106.77 R1.1 | v11.91,27.94 R7.1 | 55.72,85.09 55.72,60.96 58.1,58.58 R8.2 | 53.5,100.97 v54.77,102.39
  Bottom 1.016: v11.91,27.94 D48.A | v54.77,102.39 SV3.8 47.48,102.3 | 47.48,102.3 v45.08,102.24 | R2.2 47.48,102.3
AFN1A
  Bottom 1.016: JB44.2 S44.SW1 S44A.SW1
AFN1B
  Bottom 1.016: JA44.1 S44A.SW2 S44.SW2
D1
  Bottom 0.61: J38.2 67.47,101.28 SV1.1
D2
  Bottom 0.61: J39.2 67.47,103.82 66.04,104.93 SV1.2
D3
  Bottom 0.61: J40.2 67.47,106.36 66.2,107.47 SV1.3
GND  (via drill 0.8 pad 2.3)
  Top 0.406: 71.6,86.36 71.6,103.5 76.36,103.5
  Top 0.61: 153.19,103.5 76.36,103.5 76.04,103.5 | 24.92,48.26 17.94,48.26 v17.94,33.34 | SV3.1 59.53,80.49 62.07,86.36 71.6,86.36
  Top 0.813: v24.92,44.45 24.92,48.26 50.8,48.26 SV3.1
  Top 1.016: v155.89,101.6 155.89,103.5 153.19,103.5
  Bottom 0.406: 153.19,106.04 1D1.8
  Bottom 0.61: v17.94,33.34 C18.1 | 1D1.5 C17.1 146.69,103.98 148.75,106.04 153.19,106.04
  Bottom 1.016: 1D1.4 1D1.5 | 1D2.7 v24.92,44.45 | 1D1.8 v155.89,101.6
L1
  Bottom 0.406: 121.32,123.7 124.62,127
  Bottom 0.61: JA16.2 120.81,114.3 114.46,111.12 109.06,111.12 108.74,110.81 105.89,110.81 102.9,113.79 JA15.2 | 99.85,113.66 96.68,111.12 93,111.12 JA14.2 91.6,109.54 90.01,107.95 85.88,107.95 85.88,110.49 82.71,113.66 77.63,113.66 74.96,111 JA13.2 67.6,111 64.29,114.3 64.29,119.7 65.88,121.28 65.88,123.19 65.25,123.82 48.1,123.82 47.15,122.87 47.15,113.03 46.51,112.4 41.75,112.4 40.48,113.35 38.58,113.35 36.86,111.63 JA2.2 33.94,110.81 30.32,110.81 28.42,115.57 23.97,115.57 22.07,113.98 20.35,110.36 JA1.2 5.24,104.65 5.24,94.93 7.46,92.71 7.46,79.69 8.73,78.1 8.73,75.56 10.32,73.66 10.32,68.9 8.41,62.23 8.41,60.64 10.32,58.42 10.32,53.98 11.43,52.07 11.43,43.81 10.95,42.55 10.95,40.64 12.22,38.73 12.22,36.83 | 124.62,127 133.83,127 136.37,124.46 136.37,121.6 137.95,120.01 147.48,120.01 | 12.22,36.83 1D2.11 | 12.22,36.83 R7.2
  Bottom 0.813: 147.48,127 161.45,127 | 99.85,113.66 JA15.2
  Bottom 1.016: JA16.2 121.32,123.7 | 161.45,127 163.99,124.46 163.99,119.25 JA18.2 | 147.48,127 147.48,120.01 147.48,116.52 JA17.2
L2
  Bottom 0.61: JA23.2 147.35,87.63 146.21,87.63 141.76,84.46 139.22,84.46 137.83,83.06 JA22.2 133,83.06 129.06,87 125.89,87 122.71,84.46 119.67,84.46 JA21.2 113.32,84.33 110.65,89.22 107.79,89.22 103.35,84.46 99.35,84.46 JA20.2 93,84.33 90.33,87 87.47,87 84.3,84.46 80.3,84.46 JA19.2 74.9,84.33 74.77,84.46 69.06,84.46 66.83,86.68 61.12,86.68 | J42.2 10,78.74 8.73,80.01 8.73,86.36 12.22,89.85 16.35,89.85 18.89,92.39 JA3.2 20.67,92.58 23.02,94.93 23.02,96.2 26.19,96.2 28.73,93.98 32.54,90.81 37.12,90.81 JA4.2 40.61,92.58 42.39,94.68 42.39,103.5 43.34,104.46 56.67,104.46 57.94,103.19 57.94,101.28 56.99,100.33 55.4,100.33 54.45,99.38 54.45,94.93 57.31,93.66 57.31,90.49 61.12,87.63 61.12,86.68 | JA88.2 59.09,82.23 60.17,82.23 61.12,83.19 61.12,86.68
L2J1
  Bottom 0.61: J42.1 7.14,75.16 7.14,73.98 6.19,72.71 6.19,67.94 4.6,63.82 4.6,57.79 5.87,56.2 5.87,50.8 7.46,49.21 7.46,45.72 6.51,44.77 6.51,30.96 7.78,29.69 7.78,27.78 8.41,25.56 8.41,20 7.14,18.73 7.14,10.8 10.64,7.3 23.34,7.3 25.24,9.21 J44.2
L2J3
  Bottom 0.61: 1D2.1 26.83,29.21 27.46,28.58 27.46,25.4 24.29,22.23 23.97,21.27 J44.1
  Bottom 1.016: R4.2 1D2.1
L3
  Bottom 0.61: JA29.2 160.69,64.64 164.62,67.94 | 148.75,67.63 144.62,67.63 141.45,64.77 138.08,64.77 JA28.2 131.73,64.64 128.43,67.94 125.89,67.94 122.71,64.77 119.03,64.77 JA27.2 113.32,64.64 110.97,67.63 106.52,67.63 103.66,64.77 99.35,64.77 JA26.2 94.27,64.64 90.96,67.94 86.52,67.94 83.34,64.77 75.22,64.77 JA25.2 68.42,64.64 68.42,69.53 67.15,70.8 67.15,75.25 68.1,76.2 68.1,81.05 J47.2
  Bottom 0.813: 164.62,67.94 166.53,68.58 167.8,69.85 167.8,79.38 171.61,83.19 177.13,83.19 JA24.2
  Bottom 1.016: JA29.2 151.42,64.64 148.75,67.63
L3J
  Bottom 0.61: J45.2 13.21,72.26 JA5.2 16.16,72.39 20.8,72.39 23.97,75.56 26.83,75.56 27.78,77.79 | J49.1 22.22,91.53 22.22,89.53 27.78,84.14 27.78,77.79 | JA6.2 27.78,77.79
L3J1
  Bottom 0.61: J47.1 70.96,87.86 70.96,90.17 70.64,91.12 69.69,94.93 69.69,97.79 64.93,100.33 61.12,100.33 58.26,105.73 48.42,105.73 R2.1 J48.2
L4
  Bottom 0.406: 43.02,42.31 52.23,42.31 | 40.48,43.81 39.53,44.77
  Bottom 0.61: 166.53,49.53 163.99,48.26 162.08,46.35 158.91,46.35 JA35.2 150.78,46.23 148.11,48.58 144.94,48.58 142.08,46.35 138.59,46.35 137.83,46.23 JA34.2 131.73,46.23 129.06,48.9 125.89,48.9 123.35,46.35 119.67,46.35 JA33.2 112.68,46.23 110.01,48.9 107.16,48.9 103.98,46.35 99.35,46.35 JA32.2 93.63,46.23 90.96,48.9 87.79,48.9 85.12,46.23 JA31.2 64.48,46.23 59.91,50.8 R8.1 52.86,44.93 52.86,42.94 52.23,42.31 | 27.78,56.83 23.65,56.83 18.76,53.37 17.62,51.75 15.08,51.75 JA7.2 12.7,49.72 12.7,42.86 13.49,41.91 1D2.9 | 27.78,56.83 31.27,53.34 34.13,53.34 36.67,56.2 39.53,56.2 39.53,44.77 | JA8.2 27.97,57.02 27.78,56.83 | 43.02,42.31 40.48,43.81
  Bottom 0.813: 166.53,49.53 168.12,51.12 168.12,60.96 169.89,62.74 JA30.2
L5
  Bottom 0.406: 39.21,43.18 42.07,41.51 45.88,41.51
  Bottom 0.61: 151.92,26.67 157,26.67 | 157,26.67 160.81,26.67 163.67,29.84 164.94,29.84 | 147.8,30.48 144.62,30.48 142.4,27.94 142.4,26.67 143.67,24.13 143.67,22.23 141.76,20.32 136.68,20.32 134.78,22.23 134.78,26.35 | 129.06,29.84 132.87,26.35 134.78,26.35 | 134.78,26.35 135.73,26.35 | 97.5,26.86 90.14,26.86 86.84,30.16 86.84,33.66 86.2,34.29 80.17,34.29 74.96,28.45 JA37.2 70.01,26.35 | JA36.2 168.75,42.42 168.75,37.15 165.45,34.8 164.94,34.29 164.94,29.84 | JA42.2 173.2,26.35 170.66,26.35 167.16,29.84 164.94,29.84 | JA41.2 157,26.67 | 110.97,29.53 108.74,31.75 106.2,31.75 103.66,29.84 101.63,28.77 JA38.2 | 39.21,43.18 29.69,43.18 25.88,39.37 25.56,39.37 | 47.47,32.38 47.47,36.83 46.51,38.42 46.51,40.88 45.88,41.51 | 69.69,26.35 69.37,26.35 64.29,20.64
  Bottom 1.016: 147.8,30.48 151.92,26.67 | 129.06,29.84 125.25,29.84 122.59,27.18 JA39.2 113.32,27.18 110.97,29.53 | 135.73,26.35 JA40.2 | 97.5,26.86 JA38.2 | R6.2 25.56,39.37 1D2.5 | 70.01,26.35 69.69,26.35 | 47.47,32.38 47.47,28.58 51.59,24.45 58.9,24.45 61.75,20.64 64.29,20.64
L5O
  Bottom 0.406: 1D2.6 26.19,41.91 28.73,44.45
  Bottom 0.61: 28.73,44.45 29.37,45.09 36.12,45.09 J56.2
L6
  Bottom 0.61: JA11.2 JA12.2 JA43.2 JA44.2 JA45.2 128.78,7.97 133.19,12.38 JA46.2 | 28.84,22.12 29.05,21.91 | 1D2.3 27.34,34.29 JA9.2 28.29,30.29 29.05,29.53 29.05,24.77 | 29.05,19.37 27.15,17.78 | 27.15,17.78 24.29,17.78 23.34,16.83 23.34,10.67 JA10.2 | 29.05,9.21 27.15,11.11 27.15,17.78
  Bottom 1.016: 29.05,24.77 29.05,21.91 29.05,19.37 | R5.2 28.84,22.12 | JA11.2 33.81,7.3 30.96,7.3 29.05,9.21
N$1
  Bottom 0.61: D15.A 118.19,114.73 JB15.1
N$2
  Bottom 1.016: JB4.2 S4.SW2
N$3
  Bottom 1.016: JB1.1 D1.A
N$4
  Bottom 1.016: S4.SW1 JA4.1
N$5
  Bottom 1.016: S14.SW1 JB14.2
N$6
  Bottom 1.016: S20.SW1 104.93,89.53 JB20.2
N$7
  Bottom 1.016: S32.SW1 JB32.2
N$8
  Bottom 1.016: S38.SW2 JB38.2
N$9
  Bottom 1.016: JB6.2 S6.SW1
N$10
  Bottom 1.016: JA6.1 S6.SW2
N$11
  Bottom 1.016: JA8.1 S8.SW2
N$12
  Bottom 1.016: JB8.2 S8.SW1
N$13
  Bottom 0.61: S10.SW2 JB10.2
N$14
  Bottom 1.016: S1.SW1 JB1.2
N$15
  Bottom 1.016: JB2.1 43.34,115.57 D2.A
N$16
  Bottom 1.016: S2.SW1 JB2.2
N$17
  Bottom 1.016: JA2.1 S2.SW2
N$18
  Bottom 1.016: JB16.1 D16.A
N$19
  Bottom 1.016: JB3.2 S3.SW2
N$20
  Bottom 1.016: JB5.2 S5.SW1
N$21
  Bottom 1.016: S7.SW1 JB7.2
N$22
  Bottom 1.016: S9.SW1 JB9.2
N$23
  Bottom 1.016: S11.SW1 JB11.2
N$24
  Bottom 0.61: JB3.1 8.41,97.66 8.41,100.85 D3.A
N$25
  Bottom 1.016: S12.SW1 JB12.2
N$26
  Bottom 1.016: D5.A JB5.1
N$27
  Bottom 1.016: D7.A JB7.1
N$28
  Bottom 0.61: S10.SW1 JA10.1
N$29
  Bottom 1.016: JA1.1 S1.SW2
N$30
  Bottom 1.016: JB9.1 D9.A
N$31
  Bottom 0.61: JB11.1 43.47,20.83 39.85,24.45 39.85,26.99 45.56,32.38 D11.A
N$32
  Bottom 1.016: S3.SW1 JA3.1
N$33
  Bottom 1.016: JA5.1 S5.SW2
N$34
  Bottom 1.016: JA7.1 S7.SW2
N$35
  Bottom 1.016: JA9.1 S9.SW2
N$36
  Bottom 1.016: JA11.1 S11.SW2
N$37
  Bottom 1.016: JA12.1 S12.SW2
N$38
  Bottom 1.016: JA14.1 S14.SW2
N$39
  Bottom 1.016: S13.SW1 JB13.2
N$40
  Bottom 1.016: JA13.1 S13.SW2
N$41
  Bottom 0.61: D14.A 98.98,115.2 JB14.1
N$42
  Bottom 1.016: JB42.2 S42.SW2
N$43
  Bottom 1.016: JA42.1 S42.SW1
N$44
  Bottom 1.016: S27.SW1 JB27.2
N$45
  Bottom 1.016: S27.SW2 JA27.1
N$46
  Bottom 1.016: S17.SW1 JB17.2
N$47
  Bottom 1.016: JA17.1 S17.SW2
N$48
  Bottom 0.61: JB24.1 167.48,89.98 167.48,92.39 D24.A
N$49
  Bottom 1.016: S24.SW2 JB24.2
N$50
  Bottom 0.813: JA24.1 S24.SW1
N$51
  Bottom 0.61: J22.1 113.51,100.01 113.82,100.33 128.52,100.33 J27.2
N$52
  Bottom 0.61: D4.A 26.83,99.38 JB4.1
N$53
  Bottom 0.61: JB6.1 D6.A
N$54
  Bottom 1.016: D8.A JB8.1
N$55
  Bottom 0.61: D10.A 9.68,28.15 10,26.56 10,19.05 8.41,17.46 8.41,14.92 8.92,14.41 JB10.1
N$56
  Bottom 0.61: 70.96,24.45 70.64,24.45 67.15,20.32 64.93,18.1 64.93,15.75 JB12.1
  Bottom 1.016: 70.96,24.45 74.45,24.45 80.8,31.75 D12.A
N$57
  Bottom 0.61: JB13.1 84.41,114.3 D13.A
N$58
  Bottom 1.016: S19.SW1 JB19.2
N$59
  Bottom 1.016: S25.SW1 JB25.2
N$60
  Bottom 0.61: 1D2.8 14.76,48.67 J18.2
N$61
  Bottom 1.016: JB31.2 S31.SW1
N$62
  Bottom 1.016: S37.SW2 JB37.2
N$63
  Bottom 1.016: S44A1.SW1 S43.SW1 JB43.2
N$64
  Bottom 1.016: S26.SW1 JB26.2
N$65
  Bottom 1.016: JB41.2 S41.SW2
N$66
  Bottom 1.016: S18.SW1 JB18.2
N$67
  Bottom 0.406: 140.65,106.2 133.9,106.2 J24.2
  Bottom 0.61: 140.65,106.2 142.72,108.27 1D1.13
N$68
  Bottom 1.016: S30.SW1 JB30.2
N$69
  Bottom 1.016: S36.SW1 JB36.2
N$70
  Bottom 0.61: J25.2 113.19,107.63 116.68,103.98 123.03,103.98 127.48,108.59 J24.1
N$71  (via drill 3 pad 5)
  other vias: 175.58,3.18
N$72
  Bottom 1.016: S23.SW1 JB23.2
N$73
  Bottom 1.016: S29.SW1 JB29.2
N$74
  Bottom 1.016: S35.SW1 JB35.2
N$75
  Bottom 1.016: S41.SW1 JA41.1
N$76
  Bottom 1.016: S16.SW1 JB16.2
N$77
  Bottom 1.016: S22.SW1 143.03,90.17 JB22.2
N$78
  Bottom 1.016: JB28.2 S28.SW1
N$79
  Bottom 1.016: S34.SW1 JB34.2
N$80
  Bottom 1.016: S40.SW2 JB40.2
N$81
  Bottom 1.016: S46.SW1 JB46.2
N$82
  Bottom 1.016: S15.SW1 JB15.2
N$83
  Bottom 1.016: JB21.2 S21.SW1
N$84  (via drill 3 pad 5)
  other vias: 3.17,131.44
N$85
  Bottom 1.016: S33.SW1 JB33.2
N$86
  Bottom 1.016: S39.SW2 JB39.2
N$87
  Bottom 1.016: S45.SW1 JB45.2
N$88
  Bottom 1.016: JA15.1 S15.SW2
N$89  (via drill 3 pad 5)
  other vias: 3.17,3.18
N$90
  Bottom 1.016: JA18.1 S18.SW2
N$91
  Bottom 1.016: S20.SW2 JA20.1
N$92
  Bottom 1.016: JA22.1 S22.SW2
N$93
  Bottom 1.016: JA23.1 S23.SW2
N$94  (via drill 3 pad 5)
  other vias: 175.58,131.44
N$95
  Bottom 1.016: S25.SW2 JA25.1
N$96
  Bottom 1.016: S26.SW2 JA26.1
N$97  (via drill 3 pad 5)
  other vias: 25.56,131.44
N$98
  Bottom 1.016: JA28.1 S28.SW2
N$99
  Bottom 1.016: JA29.1 S29.SW2
N$100
  Bottom 1.016: JA30.1 S30.SW2
N$101
  Bottom 1.016: S31.SW2 JA31.1
N$102
  Bottom 1.016: S32.SW2 JA32.1
N$103
  Bottom 1.016: JA33.1 S33.SW2
N$104
  Bottom 1.016: JA34.1 S34.SW2
N$105
  Bottom 1.016: JA35.1 S35.SW2
N$106
  Bottom 1.016: JA36.1 S36.SW2
N$107  (via drill 1 pad 2)
  other vias: 63.34,25.72
N$108
  Bottom 1.016: JA38.1 S38.SW1
N$109
  Bottom 1.016: S39.SW1 JA39.1
N$110
  Bottom 1.016: S40.SW1 JA40.1
N$111
  Bottom 1.016: JB88.2 S88.SW1
N$112  (via drill 3 pad 5)
  other vias: 165.26,3.18
N$113
  Bottom 1.016: JA43.1 S44A1.SW2 S43.SW2
N$114
  Bottom 1.016: JA45.1 S45.SW2
N$115
  Bottom 1.016: JA46.1 S46.SW2
N$116
  Bottom 1.016: S19.SW2 JA19.1
N$117
  Bottom 1.016: S88.SW2 JA88.1
N$118
  Bottom 1.016: JA21.1 S21.SW2
N$119
  Bottom 1.016: JA16.1 S16.SW2
N$120
  Bottom 1.016: JB17.1 D17.A
N$121
  Bottom 1.016: JB18.1 D18.A
N$122
  Bottom 1.016: JB19.1 D19.A
N$123
  Bottom 1.016: JB20.1 D20.A
N$124
  Bottom 1.016: D21.A JB21.1
N$125
  Bottom 1.016: JB22.1 D22.A
N$126
  Bottom 0.813: D23.A JB23.1
N$127  (via drill 3 pad 5)
  other vias: 155.73,3.18
N$128
  Bottom 1.016: D25.A JB25.1
N$129
  Bottom 1.016: JB26.1 D26.A
N$130
  Bottom 1.016: JB27.1 D27.A
N$131
  Bottom 1.016: D28.A JB28.1
N$132
  Bottom 1.016: D29.A JB29.1
N$133
  Bottom 1.016: D30.A JB30.1
N$134
  Bottom 1.016: D31.A JB31.1
N$135
  Bottom 1.016: JB32.1 D32.A
N$136
  Bottom 1.016: JB33.1 D33.A
N$137
  Bottom 1.016: JB34.1 D34.A
N$138
  Bottom 1.016: D35.A JB35.1
N$139
  Bottom 1.016: JB36.1 D36.A
N$140
  Bottom 0.61: D37.A 51.59,37.78 51.59,34.92 55.72,30.8 JB37.1
N$141
  Bottom 1.016: JB38.1 90.44,35.64 D38.A
N$142
  Bottom 1.016: D39.A 109.17,35.32 JB39.1
N$143
  Bottom 1.016: D40.A JB40.1
N$144
  Bottom 0.61: JB41.1 D41.A
N$145
  Bottom 1.016: D42.A JB42.1
N$146
  Bottom 0.61: 99.22,25.08 102.39,27.62 105.68,29.53 D43.A | JB43.1 83.03,14.29 83.03,19.37 82.84,20.76
  Bottom 1.016: 82.84,20.76 85.88,24.77 99.22,25.08
N$147
  Bottom 0.61: 122.08,24.77 125.46,21.38 128.75,21.38 arc45 128.93,21.46 131.6,24.13 132.28,24.13 D44.A
  Bottom 1.016: JB44.1 107.47,20.51 108.74,23.81 110.33,25.08 122.08,24.77
N$148
  Bottom 0.61: 149.27,24.65 146.21,22.23 143.03,18.41 140.49,15.88 130.97,15.88 128.43,13.34 JB45.1
  Bottom 1.016: 149.27,24.65 D45.A
N$149
  Bottom 1.016: JB46.1 163.08,14.21 D46.A
N$151
  Bottom 1.016: D88.A JB88.1
N$152  (via drill 3 pad 5)
  other vias: 130.97,3.18
N$153  (via drill 3 pad 5)
  other vias: 106.84,3.18
N$154  (via drill 3 pad 5)
  other vias: 53.5,131.44
N$155  (via drill 3 pad 5)
  other vias: 165.26,131.44
N$156  (via drill 3 pad 5)
  other vias: 39.53,3.18
N$157  (via drill 3 pad 5)
  other vias: 142.4,131.44
N$158
  Bottom 0.61: J43.2 139.54,112.71 137.95,111.12 1D1.15
N$159  (via drill 1 pad 2)
  other vias: 165.26,101.6
N$160  (via drill 1 pad 2)
  other vias: 108.11,82.55
N$161  (via drill 1 pad 2)
  other vias: 165.26,63.5
N$162  (via drill 1 pad 2)
  other vias: 127.16,25.4
N$163
  Bottom 1.016: J27.1 135.1,101.92 1D1.1
N$164  (via drill 3 pad 5)
  other vias: 100.49,131.44
N$165
  Bottom 0.61: J28.1 136.68,103.82 137.95,102.55 1D1.2
N$166  (via drill 3 pad 5)
  other vias: 3.17,109.22
N$167  (via drill 3 pad 5)
  other vias: 3.17,90.17
N$168  (via drill 3 pad 5)
  other vias: 3.17,71.12
N$169  (via drill 3 pad 5)
  other vias: 3.17,25.4
N$170  (via drill 3 pad 5)
  other vias: 3.17,48.26
N$171  (via drill 3 pad 5)
  other vias: 81.44,131.44
N$172
  Bottom 0.406: 137.64,105.09 133.83,105.09 132.24,106.04 J29.1
  Bottom 0.61: 137.64,105.09 140.49,102.24 1D1.3
N$173  (via drill 3 pad 5)
  other vias: 119.54,131.44
N$174  (via drill 3 pad 5)
  other vias: 155.73,131.44
N$175
  Bottom 0.61: J30.1 114.14,102.55 115.41,101.6 125.89,101.6 128.43,103.82 J28.2
N$176
  Bottom 0.61: J31.1 113.82,105.09 116.2,102.71 124.55,102.71 J29.2
N$177  (via drill 3 pad 5)
  other vias: 58.58,3.18
N$178
  Bottom 0.406: 120.81,126.36 123.98,129.54
  Bottom 0.61: J33.2 45.24,123.51 46.83,125.09 59.53,125.09 62.71,128.27 77.63,128.27 80.8,125.41 82.39,125.41 85.25,128.27 96.68,128.27 99.54,125.41 102.08,125.41 104.93,128.27 115.57,128.27 117.63,126.36 120.81,126.36 | 123.98,129.54 136.68,129.54 142.4,123.82 J26.1
N$179  (via drill 3 pad 5)
  other vias: 82.71,3.18
N$180  (via drill 3 pad 5)
  other vias: 20.48,3.18
N$182
  Bottom 0.406: J38.1 76.36,101.28 77.31,100.33 84.93,100.33 85.25,100.65 J35.2
N$183
  Bottom 0.406: J39.1 76.68,103.82 78.58,101.92 84.61,101.92 85.57,102.87 J36.2
N$184
  Bottom 0.406: J40.1 76.36,106.04 79.22,103.19 83.98,103.19 84.93,104.14 89.06,104.14 90.01,105.09 J37.2
N$185
  Bottom 0.61: J37.1 95.73,105.09 97.31,103.5 103.98,103.5 105.57,105.09 J31.2
N$186
  Bottom 0.61: J36.1 95.41,102.87 96.04,102.24 106.93,102.24 J30.2
N$187
  Bottom 0.61: J35.1 104.3,100.65 104.93,100.01 J22.2
N$188
  Bottom 0.406: 120.49,127.63 123.67,130.81
  Bottom 0.61: J32.2 25.88,123.51 30.64,128.27 40.48,128.27 42.39,126.36 57.94,126.36 61.12,129.54 78.26,129.54 80.8,127 82.07,127 84.61,129.54 97.31,129.54 99.85,127 101.76,127 104.3,129.54 116.36,129.54 118.27,127.63 120.49,127.63 | 123.67,130.81 137.95,130.81 145.26,123.51 J41.1
N$189
  Bottom 0.61: J41.2 145.26,113.98 148.11,111.12 1D1.11
N$190
  Bottom 0.61: J26.2 142.4,114.3 145.57,111.12 1D1.12
N$191
  Bottom 0.406: 121.13,125.09 124.3,128.27
  Bottom 0.61: J34.2 63.98,126.36 64.93,127 76.99,127 80.17,123.82 82.71,123.82 85.88,127 95.73,127 98.9,123.82 102.39,123.82 105.57,127 115.09,127 117,125.09 121.13,125.09 | 124.3,128.27 135.41,128.27 139.54,124.14 J43.1
N$192
  Bottom 1.016: D48.C D47.A
N$193
  Bottom 0.61: J45.1 8.1,72.71 7.3,71.75 7.3,67.63 5.87,63.5 5.87,59.05 7.46,56.83 7.46,51.44 8.89,49.85 8.89,45.24 7.78,44.13 7.78,32.7 8.73,31.75 1D2.13
N$195
  Bottom 0.406: 46.51,81.91 46.51,90.17 46.83,90.49
  Bottom 0.61: 46.83,90.49 48.58,92.23 SV3.4 | J53.1 49.37,51.12 51.59,53.34 51.59,58.1 50.64,59.05 50.64,69.53 50.32,69.85 50.32,78.1 46.51,81.91
N$196
  Bottom 0.406: 45.56,80.01 45.56,92.71 45.88,93.03
  Bottom 0.61: 45.88,93.03 47.62,94.77 SV3.5 | J51.1 49.05,53.66 49.69,54.29 49.69,57.47 49.05,58.1 49.05,68.9 48.1,69.85 48.1,77.47 45.56,80.01
N$197
  Bottom 0.406: 1D2.10 16.03,39.37 16.67,40.01 16.67,47.31
  Bottom 0.61: 16.67,47.31 16.67,47.94 19.53,50.8 20.16,52.71 23.97,55.56 27.15,55.56 30.96,51.75 34.45,51.75 36.35,53.66 J23.2
N$198
  Bottom 0.406: 47.78,83.5 47.78,88.26 49.21,89.69 SV3.3
  Bottom 0.61: 47.78,83.5 52.23,79.06 52.23,59.37 53.5,58.1 53.5,52.71 49.37,48.58 J55.1
N$199
  Bottom 0.61: SV3.2 53.34,87.15 54.13,84.14 | 54.13,74.29 54.13,60.01 55.72,58.42 55.72,52.07 50.01,46.04 J57.1
  Bottom 0.813: 54.13,84.14 54.13,74.29
N$200
  Bottom 0.406: 43.66,76.52 43.66,98.11 43.97,98.43
  Bottom 0.61: J18.1 19.84,55.88 23.34,58.1 25.88,58.1 27.15,59.37 27.15,66.99 30.64,70.49 43.02,70.49 43.66,71.12 43.66,76.52 | 43.97,98.43 45.4,99.85 SV3.7
N$201  (via drill 1 pad 2)
  other vias: 146.21,63.5
N$202  (via drill 1 pad 2)
  other vias: 89.06,44.45
N$203
  Bottom 0.406: 44.61,77.79 44.61,95.25 44.93,95.57
  Bottom 0.61: 44.93,95.57 46.67,97.31 SV3.6 | J46.1 47.47,56.29 47.47,67.31 45.88,68.9 45.88,76.52 44.61,77.79
N$204  (via drill 1 pad 2)
  other vias: 127.16,44.45
N$205  (via drill 1 pad 2)
  other vias: 165.26,44.45
N$207  (via drill 1 pad 2)
  other vias: 146.21,26.67
N$208  (via drill 1 pad 2)
  other vias: 119.54,109.22
N$209  (via drill 1 pad 2)
  other vias: 165.26,82.55
N$210  (via drill 1 pad 2)
  other vias: 146.21,82.55
N$211  (via drill 1 pad 2)
  other vias: 127.16,82.55
N$212  (via drill 1 pad 2)
  other vias: 127.16,63.5
N$213  (via drill 1 pad 2)
  other vias: 108.11,63.5
N$214  (via drill 1 pad 2)
  other vias: 89.06,63.5
N$215  (via drill 1 pad 2)
  other vias: 104.93,24.45
N$216  (via drill 1 pad 2)
  other vias: 27.15,90.17
N$217  (via drill 1 pad 2)
  other vias: 108.11,44.45
N$218  (via drill 1 pad 2)
  other vias: 81.44,109.22
N$219  (via drill 1 pad 2)
  other vias: 100.49,109.22
N$220  (via drill 1 pad 2)
  other vias: 165.26,109.22
N$221  (via drill 1 pad 2)
  other vias: 89.06,82.55
N$224
  Bottom 0.61: J48.1 38.26,110.81 35.4,109.22 29.37,109.22 27.78,106.36 27.78,105.73 27.15,105.41 23.65,105.41 23.65,99.38 24.61,98.74 J49.2
N$225
  Bottom 1.016: J46.2 J23.1
N$226  (via drill 1 pad 2)
  other vias: 25.56,52.07
N$227  (via drill 1 pad 2)
  other vias: 25.56,71.12
N$228  (via drill 1 pad 2)
  other vias: 25.56,109.22
N$229
  Bottom 0.406: 1D2.12 16.03,34.29 17.3,35.56 17.3,38.73 17.62,39.37 17.62,46.35 20.16,48.9 28.42,48.9
  Bottom 0.61: 28.42,48.9 29.69,48.9 30.64,49.85 34.77,49.85 37.31,52.39 J50.2
N$230
  Bottom 1.016: J51.2 J50.1
N$231
  Bottom 0.406: 30.32,47.62 20.8,47.62 18.57,45.72 18.57,37.15 20.48,32.7 1D2.2
  Bottom 0.61: 30.32,47.62 31.27,48.58 35.72,48.58 37.31,50.16 J52.2
N$232
  Bottom 1.016: J53.2 J52.1
N$233
  Bottom 0.406: 1D2.4 21.11,36.83 19.84,38.42 19.84,45.09 21.11,46.35 30.32,46.35
  Bottom 0.61: 37.62,47.94 J54.2 36.12,46.99 31.59,46.99 30.96,46.35 30.32,46.35
N$234
  Bottom 1.016: S37.SW1 JA37.1
N$235
  Bottom 1.016: J55.2 J54.1
N$237
  Bottom 1.016: J57.2 J56.1
N$238
  Bottom 1.016: R3.2 R6.1
N$242  (via drill 1 pad 2)
  other vias: 60.17,63.5
N$243  (via drill 1 pad 2)
  other vias: 65.25,82.55
N$245  (via drill 1 pad 2)
  other vias: 44.61,25.4
N$348  (via drill 1 pad 2)
  other vias: 146.21,44.45
N$390
  Bottom 0.61: 1D1.6 148.11,103.19 149.54,104.46 R1.2
N$395  (via drill 3 pad 5)
  other vias: 181.13,131.44
VCCD2
  Bottom 1.016: 1D2.14 C18.2 R4.1 20.48,27.62 D47.C R5.1 R3.1
(copper drawn outside any net)
  shapes: Top area x2

## Text on the board
Bottom: 1178-16